# Altium schematic sheet Main.SchDoc
size A4; SheetNumber: 1; SheetTotal: 3
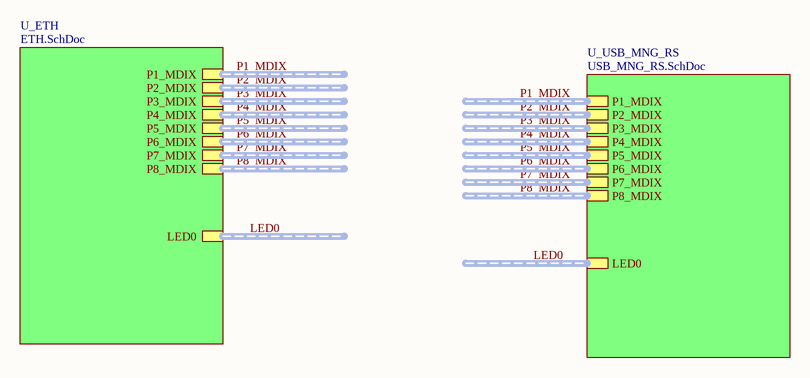
[diagram p0: Main.SchDoc]

## Sub-sheets
U_ETH = ETH.SchDoc: P1_MDIX (harness MDIX_1), P8_MDIX (harness MDIX_8), P4_MDIX (harness MDIX_4), P7_MDIX (harness MDIX_7), P3_MDIX (harness MDIX_3), P6_MDIX (harness MDIX_6), P5_MDIX (harness MDIX_5), P2_MDIX (harness MDIX_2), LED0 (harness LED0)
U_USB_MNG_RS = USB_MNG_RS.SchDoc: P1_MDIX (harness MDIX_1), P3_MDIX (harness MDIX_3), P5_MDIX (harness MDIX_5), P7_MDIX (harness MDIX_7), P4_MDIX (harness MDIX_4), P6_MDIX (harness MDIX_6), P8_MDIX (harness MDIX_8), P2_MDIX (harness MDIX_2), LED0 (harness LED0)

## Buses and harness runs
harness LED0 = sheet U_ETH/LED0
harness LED0 = sheet U_USB_MNG_RS/LED0
harness P1_MDIX = sheet U_ETH/P1_MDIX
harness P1_MDIX = sheet U_USB_MNG_RS/P1_MDIX
harness P2_MDIX = sheet U_ETH/P2_MDIX
harness P2_MDIX = sheet U_USB_MNG_RS/P2_MDIX
harness P3_MDIX = sheet U_ETH/P3_MDIX
harness P3_MDIX = sheet U_USB_MNG_RS/P3_MDIX
harness P4_MDIX = sheet U_ETH/P4_MDIX
harness P4_MDIX = sheet U_USB_MNG_RS/P4_MDIX
harness P5_MDIX = sheet U_ETH/P5_MDIX
harness P5_MDIX = sheet U_USB_MNG_RS/P5_MDIX
harness P6_MDIX = sheet U_ETH/P6_MDIX
harness P6_MDIX = sheet U_USB_MNG_RS/P6_MDIX
harness P7_MDIX = sheet U_ETH/P7_MDIX
harness P7_MDIX = sheet U_USB_MNG_RS/P7_MDIX
harness P8_MDIX = sheet U_ETH/P8_MDIX
harness P8_MDIX = sheet U_USB_MNG_RS/P8_MDIX